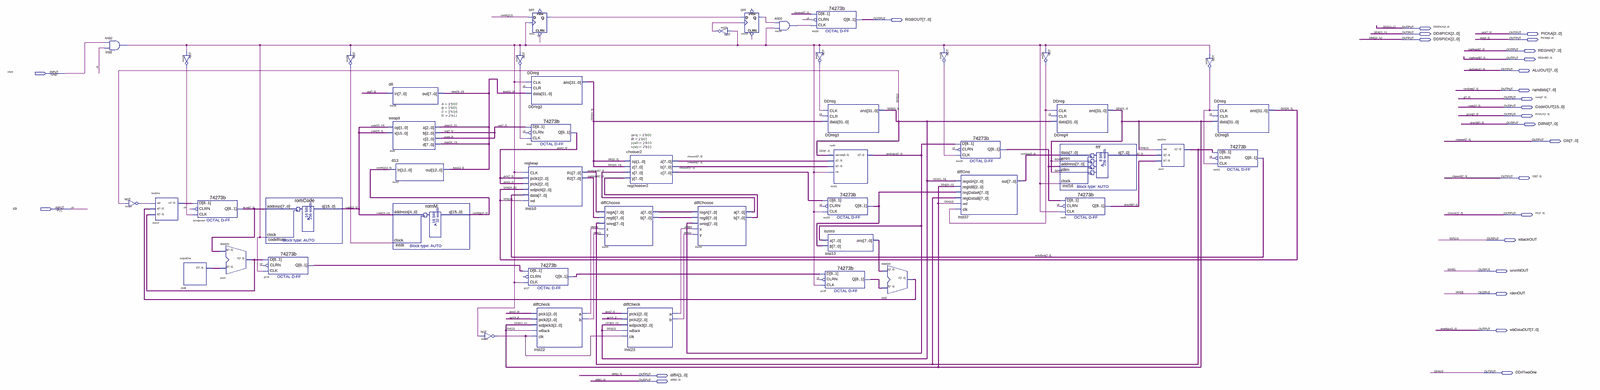
[diagram p0: schematic sheet, whole]
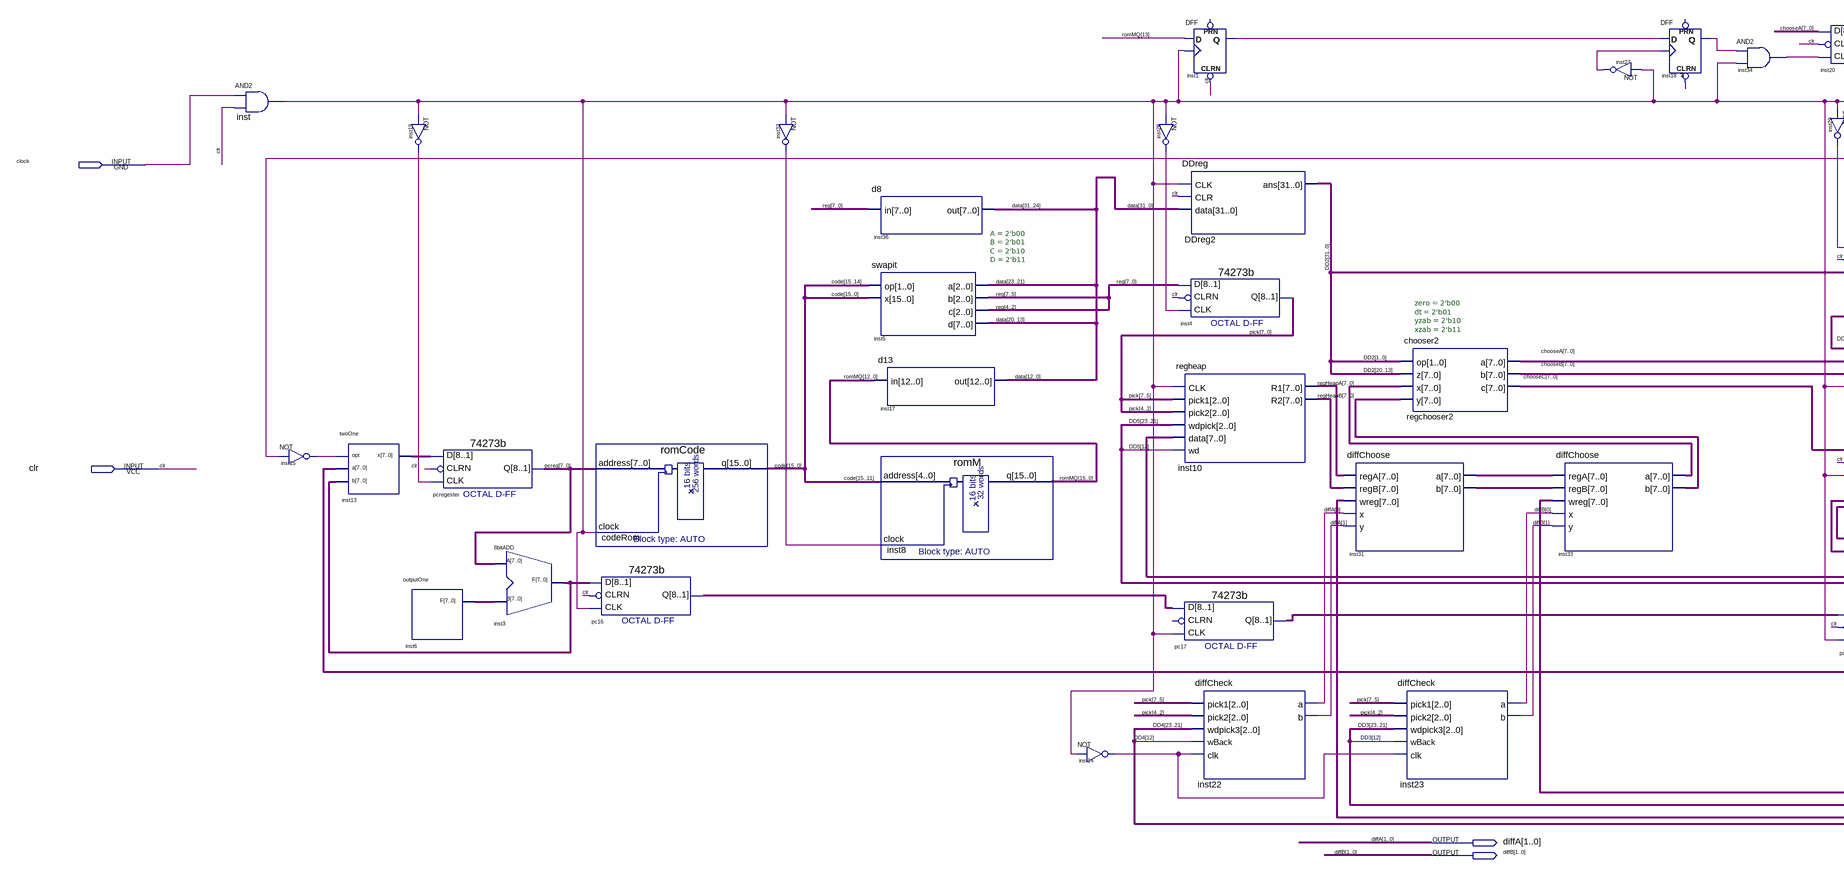
[diagram p1: schematic sheet, left part]
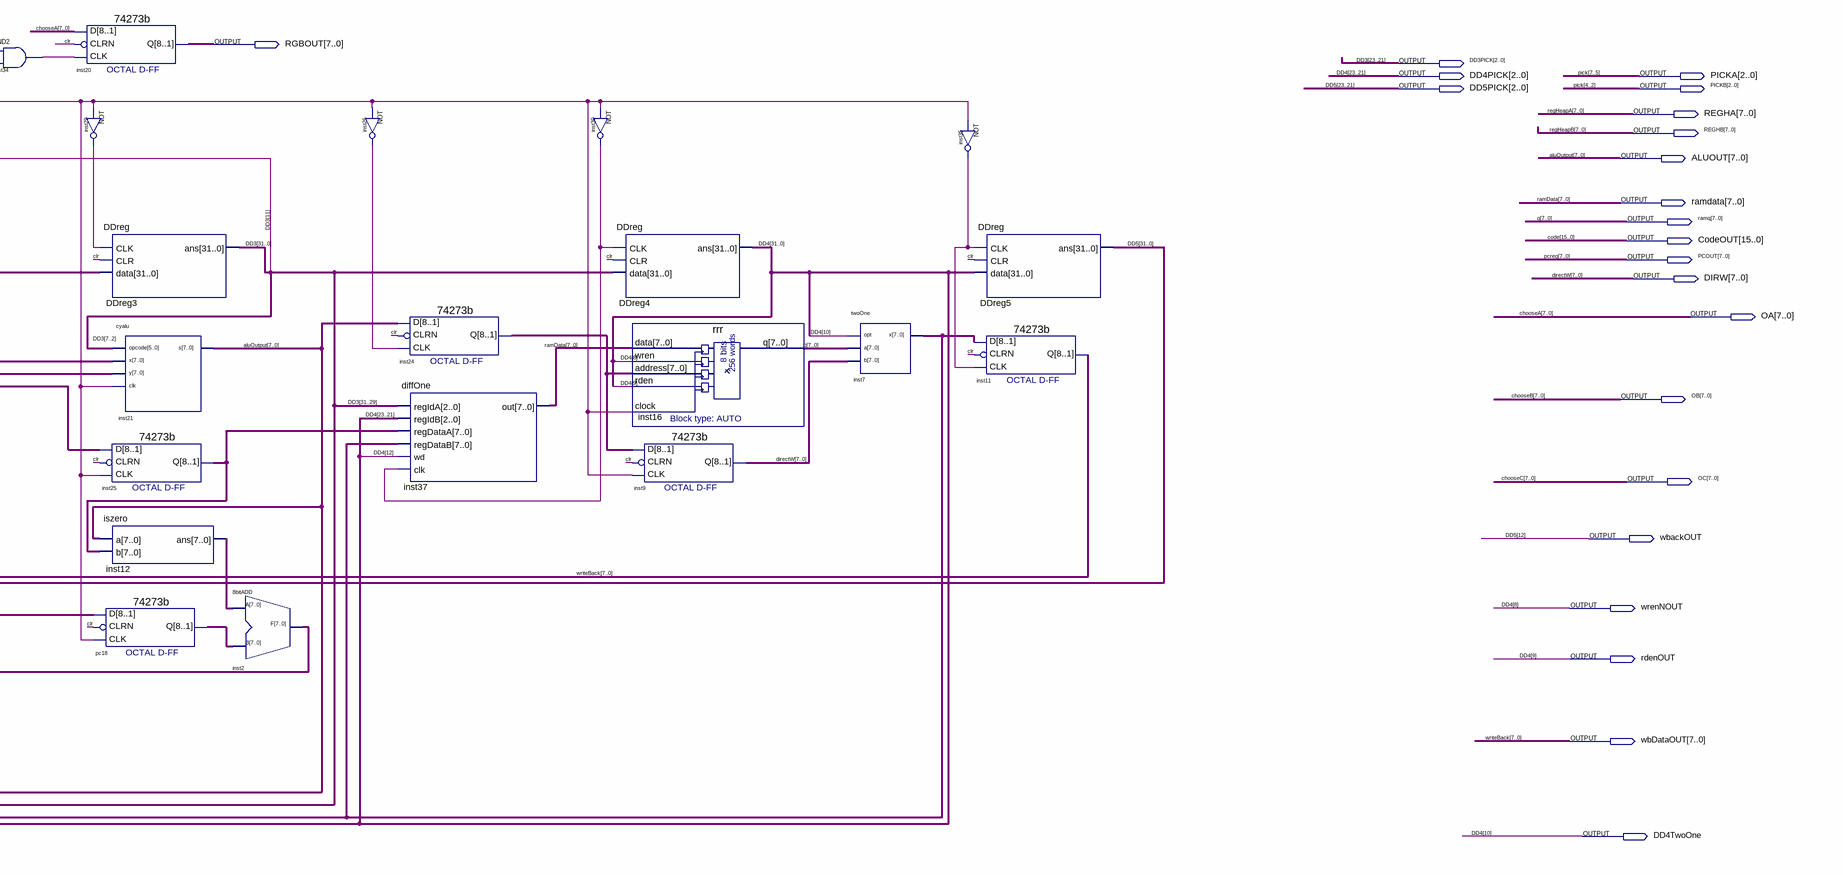
[diagram p2: schematic sheet, right part]
// Quartus schematic cpu.bdf as structural Verilog: 48 symbols, 26 pins
module cpu (
  input  clock,
  input  clr,
  output [7:0] RGBOUT,
  output [2:0] DD3PICK,
  output [2:0] DD4PICK,
  output [2:0] PICKA,
  output [2:0] DD5PICK,
  output [2:0] PICKB,
  output [7:0] REGHA,
  output [7:0] REGHB,
  output [7:0] ALUOUT,
  output [7:0] ramdata,
  output [7:0] ramq,
  output [15:0] CodeOUT,
  output [7:0] PCOUT,
  output [7:0] DIRW,
  output [7:0] OA,
  output [7:0] OB,
  output [7:0] OC,
  output wbackOUT,
  output wrenNOUT,
  output rdenOUT,
  output [7:0] wbDataOUT,
  output DD4TwoOne,
  output [1:0] diffA,
  output [1:0] diffB
);

  wire inst1_q, inst14_out, inst15_out, inst18_q, inst19_out, inst26_out, inst27_out, inst28_out, inst29_out,
       inst30_out, inst32_out, inst34_out, inst35_out, inst_out;
  wire [1:0] pick;
  wire [7:0] inst2_f, inst3_f, inst6_f, inst7_x, inst12_ans, inst13_x, inst24_q, inst25_q, inst31_a,
       inst31_b, inst33_a, inst33_b, pc16_q, pc17_q, pc18_q, \reg ;
  wire [15:0] romMQ;
  wire [31:0] data, DD2, DD3, DD4, DD5;

  and inst (inst_out, clock, clr);
  not inst15 (inst15_out, DD3[11]);
  twoOne inst13 (.opt(inst15_out), .a(inst2_f), .b(inst3_f), .x(inst13_x));
  not inst19 (inst19_out, inst_out);
  \74273b  pcregester (.CLK(inst19_out), .D(inst13_x), .CLRN(clr), .Q(PCOUT));
  outputOne inst6 (.F(inst6_f));
  \8bitADD  inst3 (.A(PCOUT), .B(inst6_f), .F(inst3_f));
  \74273b  pc16 (.CLK(inst_out), .D(inst3_f), .CLRN(clr), .Q(pc16_q));
  romCode codeRom (.address(PCOUT), .clock(inst_out), .q(CodeOUT));
  not inst32 (inst32_out, inst_out);
  d8 inst36 (.in(\reg ), .out(data[31:24]));
  swapit #(.A(2'b00), .B(2'b01), .C(2'b10), .D(2'b11)) inst5 (
    .op(CodeOUT[15:14]), .x(CodeOUT), .a(data[23:21]), .b(\reg [7:5]), .c(\reg [4:2]), .d(data[20:13]));
  d13 inst17 (.in(romMQ[12:0]), .out(data[12:0]));
  romM inst8 (.address(CodeOUT[15:11]), .clock(inst32_out), .q(romMQ));
  not inst14 (inst14_out, inst_out);
  DFF inst1 (.CLRN(clr), .CLK(inst_out), .D(romMQ[13]), .Q(inst1_q));  // open: PRN
  not inst28 (inst28_out, inst_out);
  DDreg DDreg2 (.CLK(inst_out), .CLR(clr), .data(data), .ans(DD2));
  \74273b  inst4 (.CLK(inst28_out), .D(\reg ), .CLRN(clr), .Q({PICKA, PICKB, pick}));
  regheap inst10 (
    .CLK(inst_out), .pick1(PICKA), .pick2(PICKB), .wdpick(DD5PICK), .data(wbDataOUT), .wd(wbackOUT),
    .R1(REGHA), .R2(REGHB));
  \74273b  pc17 (.CLK(inst_out), .D(pc16_q), .Q(pc17_q));  // open: CLRN
  diffCheck inst22 (
    .pick1(PICKA), .pick2(PICKB), .wdpick3(DD4PICK), .wBack(DD4[12]), .clk(inst14_out), .a(diffA[0]),
    .b(diffA[1]));
  diffChoose inst31 (
    .regA(REGHA), .regB(REGHB), .wreg(inst7_x), .x(diffA[0]), .y(diffA[1]), .a(inst31_a), .b(inst31_b));
  chooser2 #(.zero(2'b00), .dt(2'b01), .yzab(2'b10), .xzab(2'b11)) regchooser2 (
    .op(DD2[1:0]), .z(DD2[20:13]), .x(inst33_a), .y(inst33_b), .a(OA), .b(OB), .c(OC));
  diffCheck inst23 (
    .pick1(PICKA), .pick2(PICKB), .wdpick3(DD3PICK), .wBack(DD3[12]), .clk(inst14_out), .a(diffB[0]),
    .b(diffB[1]));
  diffChoose inst33 (
    .regA(inst31_a), .regB(inst31_b), .wreg(ALUOUT), .x(diffB[0]), .y(diffB[1]), .a(inst33_a), .b(inst33_b));
  not inst27 (inst27_out, inst_out);
  DFF inst18 (.CLRN(clr), .CLK(inst27_out), .D(inst1_q), .Q(inst18_q));  // open: PRN
  and inst34 (inst34_out, inst18_q, inst_out);
  \74273b  inst20 (.CLK(inst34_out), .D(OA), .CLRN(clr), .Q(RGBOUT));
  not inst29 (inst29_out, inst_out);
  DDreg DDreg3 (.CLK(inst29_out), .CLR(clr), .data(DD2), .ans({DD3[31:24], DD3PICK, DD3[20:0]}));
  cyalu inst21 (.opcode(DD3[7:2]), .x(OA), .y(OB), .clk(inst_out), .s(ALUOUT));
  \74273b  inst25 (.CLK(inst_out), .D(OC), .CLRN(clr), .Q(inst25_q));
  iszero inst12 (.a(ALUOUT), .b(inst25_q), .ans(inst12_ans));
  \74273b  pc18 (.CLK(inst_out), .D(pc17_q), .CLRN(clr), .Q(pc18_q));
  \8bitADD  inst2 (.A(inst12_ans), .B(pc18_q), .F(inst2_f));
  not inst26 (inst26_out, inst_out);
  \74273b  inst24 (.CLK(inst26_out), .D(ALUOUT), .CLRN(clr), .Q(inst24_q));
  diffOne inst37 (
    .regIdA(DD3[31:29]), .regIdB(DD4PICK), .regDataA(inst25_q), .regDataB(inst7_x), .wd(DD4[12]),
    .clk(inst30_out), .out(ramdata));
  not inst30 (inst30_out, inst_out);
  DDreg DDreg4 (
    .CLK(inst30_out), .CLR(clr), .data({DD3[31:24], DD3PICK, DD3[20:0]}),
    .ans({DD4[31:24], DD4PICK, DD4[20:11], DD4TwoOne, rdenOUT, wrenNOUT, DD4[7:0]}));
  rrr inst16 (.data(ramdata), .wren(wrenNOUT), .address(inst24_q), .rden(rdenOUT), .clock(inst_out), .q(ramq));
  \74273b  inst9 (.CLK(inst_out), .D(inst24_q), .CLRN(clr), .Q(DIRW));
  twoOne inst7 (.opt(DD4TwoOne), .a(ramq), .b(DIRW), .x(inst7_x));
  not inst35 (inst35_out, inst_out);
  DDreg DDreg5 (
    .CLK(inst35_out), .CLR(clr),
    .data({DD4[31:24], DD4PICK, DD4[20:11], DD4TwoOne, rdenOUT, wrenNOUT, DD4[7:0]}),
    .ans({DD5[31:24], DD5PICK, DD5[20:13], wbackOUT, DD5[11:0]}));
  \74273b  inst11 (.CLK(inst35_out), .D(inst7_x), .CLRN(clr), .Q(wbDataOUT));

  // Other names for the same wires on the sheet: aluOutput[7:0] = ALUOUT; chooseA[7:0] = OA; chooseB[7:0] = OB;
  //   chooseC[7:0] = OC; code[15:0] = CodeOUT; DD3[23:21] = DD3PICK;
  //   DD4 (some bits) = {DD4PICK, DD4TwoOne, rdenOUT, wrenNOUT}; DD5 (some bits) = {DD5PICK, wbackOUT};
  //   directW[7:0] = DIRW; pcreg[7:0] = PCOUT; pick[7:2] = {PICKA, PICKB}; q[7:0] = ramq; regHeapA[7:0] = REGHA;
  //   regHeapB[7:0] = REGHB; writeBack[7:0] = wbDataOUT
endmodule
